# Altium schematic sheet ExtendBoard.SchDoc
size A4
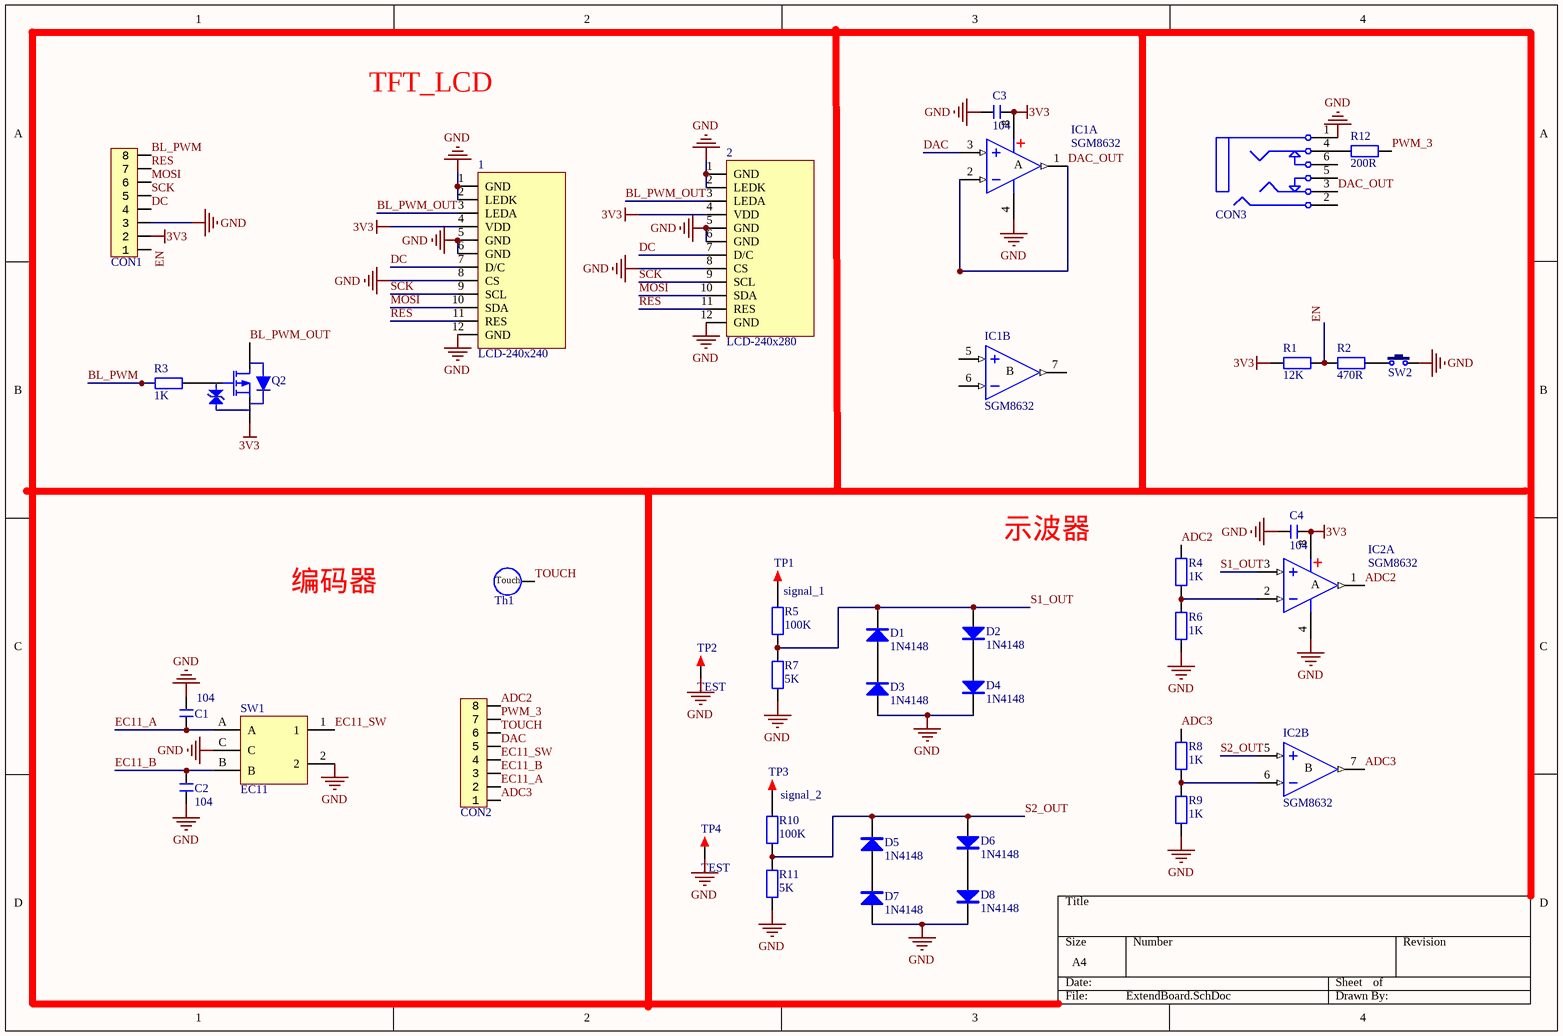
[diagram p0: ExtendBoard.SchDoc]

## Parts
1  LCD-240x240  [LCD-240x240-NoHole]
2  LCD-240x280  [LCD-ST7789]
C1  104  [C 0603]
C2  104  [C 0603]
C3  104  [C 0603]
C4  104  [C 0603]
CON1  FFC_0.5_8  [FFC_0.5_8]  (value not drawn)
CON2  FFC_0.5_8  [FFC_0.5_8]  (value not drawn)
CON3  PJ342  [PJ342A]  (value not drawn)
D1  1N4148  [SOD-323]
D2  1N4148  [SOD-323]
D3  1N4148  [SOD-323]
D4  1N4148  [SOD-323]
D5  1N4148  [SOD-323]
D6  1N4148  [SOD-323]
D7  1N4148  [SOD-323]
D8  1N4148  [SOD-323]
IC1  SGM8632  [SOP8_N]  (parts A,B of 2)
IC2  SGM8632  [SOP8_N]  (parts A,B of 2)
Q2  AO3415A  [SOT23-3]  (value not drawn)
R1  12K  [R 0603]
R2  470R  [R 0603]
R3  1K  [R 0603]
R4  1K  [R 0603]
R5  100K  [R 0603]
R6  1K  [R 0603]
R7  5K  [R 0603]
R8  1K  [R 0603]
R9  1K  [R 0603]
R10  100K  [R 0603]
R11  5K  [R 0603]
R12  200R  [R 0603]
SW1  EC11  [EC11-DEEP]
SW2  3x6x5  [TSW 3*6*4.3-S-W]  (value not drawn)
Th1  Touch 10X10mm  [Touch-5X5mm]  (value not drawn)
TP1  signal_1  [TEST 2.0]
TP2  TEST  [TEST 2.0]
TP3  signal_2  [TEST 2.0]
TP4  TEST  [TEST 2.0]

## Nets
3V3: 1.4(VDD) 2.4(VDD) C3.2 C4.2 CON1.2 IC1.8(V+) IC2.8(V+) Q2.2(S) R1.2
GND: 1.1(GND) 1.2(LEDK) 1.5(GND) 1.6(GND) 1.8(CS) 1.12(GND) 2.1(GND) 2.2(LEDK) 2.5(GND) 2.6(GND) 2.8(CS) 2.12(GND) C1.2 C2.1 C3.1 C4.1 CON1.3 CON3.1 D3.1(A) D4.2(K) D7.1(A) D8.2(K) IC1.4(V-) IC2.4(V-) R6.1 R7.1 R9.1 R11.1 SW1.2 SW1.C SW2.2 TP2.1 TP4.1
ADC2: CON2.8 IC2.1(OUT) R4.2
ADC3: CON2.1 IC2.7(OUT) R8.2
BL_PWM: CON1.8 R3.1
BL_PWM_OUT: 1.3(LEDA) 2.3(LEDA) Q2.3(D)
DAC: CON2.5 IC1.3(IN+)
DAC_OUT: CON3.3 IC1.1(OUT) IC1.2(IN-)
DC: 1.7(D/C) 2.7(D/C) CON1.4
EC11_A: C1.1 CON2.2 SW1.A
EC11_B: C2.2 CON2.3 SW1.B
EC11_SW: CON2.4 SW1.1
EN: CON1.1 R1.1 R2.2
MOSI: 1.10(SDA) 2.10(SDA) CON1.6
PWM_3: CON2.7 R12.2
RES: 1.11(RES) 2.11(RES) CON1.7
S1_OUT: D1.2(K) D2.1(A) IC2.3(IN+) R5.1 R7.2
S2_OUT: D5.2(K) D6.1(A) IC2.5(IN+) R10.1 R11.2
SCK: 1.9(SCL) 2.9(SCL) CON1.5
TOUCH: CON2.6 Th1.Touch
NetCON3_4: CON3.4 R12.1
NetD1_1: D1.1(A) D3.2(K)
NetD2_2: D2.2(K) D4.1(A)
NetD5_1: D5.1(A) D7.2(K)
NetD6_2: D6.2(K) D8.1(A)
NetIC2_2: IC2.2(IN-) R4.1 R6.2
NetIC2_6: IC2.6(IN-) R8.1 R9.2
NetQ2_1: Q2.1(G) R3.2
NetR2_1: R2.1 SW2.1
NetR5_2: R5.2 TP1.1
NetR10_2: R10.2 TP3.1

Not connected (* = marked no-connect by the designer): CON3 2 5 6; IC1 5(IN+) 6(IN-) 7(OUT)

## Notes on the sheet
- TFT_LCD
- 示波器
- 编码器
- (in symbol SGM8632, part A) A
- (in symbol SGM8632, part B) B

## Library data of the parts
1 2 = LCD-240x240: 显示屏
C1-C4 = C: 无极性贴片电容; 版权归属: 源创客; BOM名称: 无极性贴片电容; 学习资源: www.ooocke.com
CON1 CON2 = FFC_0.5_8: FFC; System: Connector
CON3 = PJ342: 3.5耳机插座,4Pin; BOM名称: 耳机插座
D1-D8 = 1N4148: 高速开关二极管; BOM名称: 高速开关二极管
IC1 IC2 = SGM8632: 轨到轨双路运放
Q2 = AO3415A: MOSFET; Published: 8-Jun-2000; LatestRevisionDate: 17-Jul-2002; LatestRevisionNote: Re-released for DXP Platform.; PackageVersion: 1995/1996; PackageReference: E3; Publisher: Altium Limited; PackageDescription: TO, Flat Index; 3 In-Line, Axial Leads; Body Dia. 4.6mm; Lead Dia. 0.5 mm (max)
R1-R12 = R: 贴片电阻; 版权归属: 源创客; BOM名称: 贴片电阻; 学习资源: www.ooocke.com
SW1 = EC11: 数字开关编码器; BOM名称: 数字编码开关; 版权归属: 源创客; 学习资源: www.ooocke.com
SW2 = TSW 3x6: 3x6轻触开关; 版权归属: 源创客; BOM名称: 3x6轻触开关; 学习资源: www.ooocke.com
Th1 = Touch-1P: 触控焊盘; BOM名称: 触控焊盘
TP1-TP4 = TEST: 测试点; BOM名称: 测试点